# Altium schematic sheet Analog Output.SchDoc
size A4; SheetNumber: 3; SheetTotal: 9
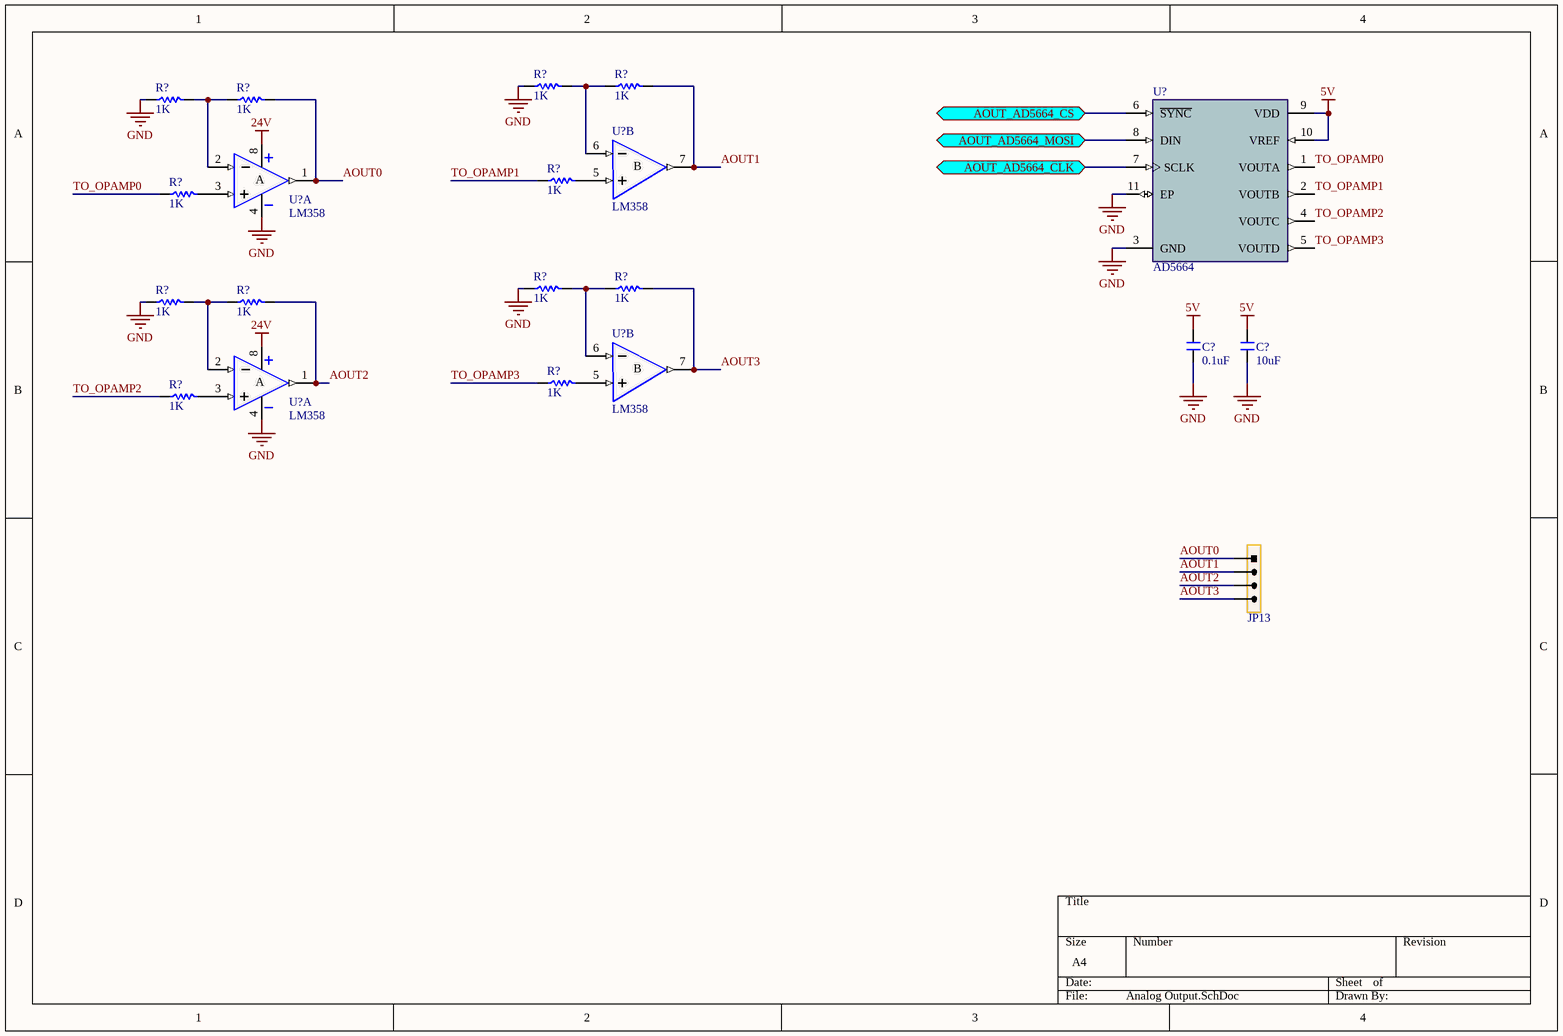
[diagram p0: Analog Output.SchDoc]

## Parts
(Parts that share a designator on the sheet are numbered #1, #2 ... from top to bottom, then left to right.)
C?#1  0.1uF  [C 0805]
C?#2  10uF  [C 0805]
JP13  HDR-1X4  [KF-4P-BLK-H-3.81]  (value not drawn)
R?#1  1K  [R 0805]
R?#2  1K  [R 0805]
R?#3  1K  [R 0805]
R?#4  1K  [R 0805]
R?#5  1K  [R 0805]
R?#6  1K  [R 0805]
R?#7  1K  [R 0805]
R?#8  1K  [R 0805]
R?#9  1K  [R 0805]
R?#10  1K  [R 0805]
R?#11  1K  [R 0805]
R?#12  1K  [R 0805]
U?#1  LM358  [SOP8_N]  (part B of 2)
U?#2  AD5664  [LFCSP -10]
U?#3  LM358  [SOP8_N]  (part A of 2)
U?#4  LM358  [SOP8_N]  (part B of 2)
U?#5  LM358  [SOP8_N]  (part A of 2)

## Ports
AOUT_AD5664_CLK (bidir), AOUT_AD5664_CS (bidir), AOUT_AD5664_MOSI (bidir)

## Nets
5V: C?#1.2 C?#2.2 U?#2.9(VDD) U?#2.10(VREF)
24V: U?#3.8(VCC+) U?#5.8(VCC+)
GND: C?#1.1 C?#2.1 R?#1.1 R?#3.1 R?#7.1 R?#9.1 U?#2.3(GND) U?#2.11(EP) U?#3.4(VCC-) U?#5.4(VCC-)
AOUT0: JP13.1 R?#4.2 U?#3.1(OUT1)
AOUT1: JP13.2 R?#2.2 U?#1.7(OUT2)
AOUT2: JP13.3 R?#10.2 U?#5.1(OUT1)
AOUT3: JP13.4 R?#8.2 U?#4.7(OUT2)
AOUT_AD5664_CLK: U?#2.7(SCLK) ; port AOUT_AD5664_CLK
AOUT_AD5664_CS: U?#2.6(~{SYNC}) ; port AOUT_AD5664_CS
AOUT_AD5664_MOSI: U?#2.8(DIN) ; port AOUT_AD5664_MOSI
TO_OPAMP0: R?#6.1 U?#2.1(VOUTA)
TO_OPAMP1: R?#5.1 U?#2.2(VOUTB)
TO_OPAMP2: R?#12.1 U?#2.4(VOUTC)
TO_OPAMP3: R?#11.1 U?#2.5(VOUTD)
NetR?#1_2: R?#1.2 R?#2.1 U?#1.6(IN2-)
NetR?#3_2: R?#3.2 R?#4.1 U?#3.2(IN1-)
NetR?#5_2: R?#5.2 U?#1.5(IN2+)
NetR?#6_2: R?#6.2 U?#3.3(IN1+)
NetR?#7_2: R?#7.2 R?#8.1 U?#4.6(IN2-)
NetR?#9_2: R?#9.2 R?#10.1 U?#5.2(IN1-)
NetR?#11_2: R?#11.2 U?#4.5(IN2+)
NetR?#12_2: R?#12.2 U?#5.3(IN1+)

## Notes on the sheet
- (in symbol LM358, part A) A
- (in symbol LM358, part B) B

## Library data of the parts
C?#1 C?#2 = C: Non-polar patch capacitor; BOM名称: 无极性贴片电容; 版权归属: 源创客; 学习资源: www.ooocke.com
JP13 = Header 4: 4P Connector; BOM名称: 4P接插件; 版权归属: 源创客; 学习资源: www.ooocke.com
R?#1-R?#12 = R: Chip resistor; 版权归属: 源创客; BOM名称: Chip resistor; 学习资源: www.ooocke.com
U?#1 U?#3-U?#5 = LM358: Dual op amp; BOM名称: 双路运放; 版权归属: 源创客; 学习资源: www.ooocke.com